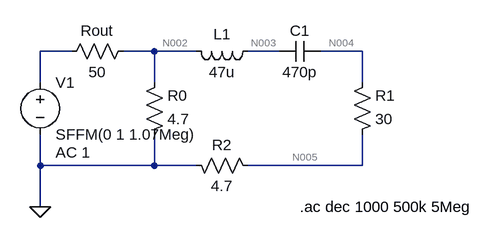
[diagram p0: schematic (1)(a).asc]
(1)(a).asc, the LTspice schematic file:
Version 4
SHEET 1 880 680
WIRE 0 32 -48 32
WIRE 128 32 80 32
WIRE 192 32 128 32
WIRE 320 32 272 32
WIRE 448 32 384 32
WIRE -48 80 -48 32
WIRE 128 80 128 32
WIRE 448 80 448 32
WIRE -48 208 -48 160
WIRE 128 208 128 160
WIRE 128 208 -48 208
WIRE 192 208 128 208
WIRE 448 208 448 160
WIRE 448 208 272 208
WIRE -48 272 -48 208
FLAG -48 272 0
SYMBOL res 96 16 R90
WINDOW 0 0 56 VBottom 2
WINDOW 3 32 56 VTop 2
SYMATTR InstName Rout
SYMATTR Value 50
SYMBOL res 112 176 M180
WINDOW 0 36 76 Left 2
WINDOW 3 36 40 Left 2
SYMATTR InstName R0
SYMATTR Value 4.7
SYMBOL res 176 192 M90
WINDOW 0 0 56 VBottom 2
WINDOW 3 32 56 VTop 2
SYMATTR InstName R2
SYMATTR Value 4.7
SYMBOL res 432 176 M180
WINDOW 0 36 76 Left 2
WINDOW 3 36 40 Left 2
SYMATTR InstName R1
SYMATTR Value 30
SYMBOL cap 384 16 R90
WINDOW 0 0 32 VBottom 2
WINDOW 3 32 32 VTop 2
SYMATTR InstName C1
SYMATTR Value 470p
SYMATTR SpiceLine Rser=9.0
SYMBOL ind 288 16 R90
WINDOW 0 5 56 VBottom 2
WINDOW 3 32 56 VTop 2
SYMATTR InstName L1
SYMATTR Value 47u
SYMATTR SpiceLine Rser=5 Cpar=55p
SYMBOL voltage -48 64 R0
WINDOW 123 24 124 Left 2
WINDOW 39 0 0 Left 2
SYMATTR Value2 AC 1
SYMATTR InstName V1
SYMATTR Value SFFM(0 1 1.07Meg)
TEXT 352 272 Left 2 !.ac dec 1000 500k 5Meg

The netlist it stands for:
* (1)(a).asc
Rout N002 N001 50
R0 0 N002 4.7
R2 0 N005 4.7
R1 N005 N004 30
C1 N004 N003 470p Rser=9.0
L1 N003 N002 47u Rser=5 Cpar=55p
V1 N001 0 SFFM(0 1 1.07Meg) AC 1
.ac dec 1000 500k 5Meg
.backanno
.end

* Results of the author's LTspice run, read from the files saved beside the schematic
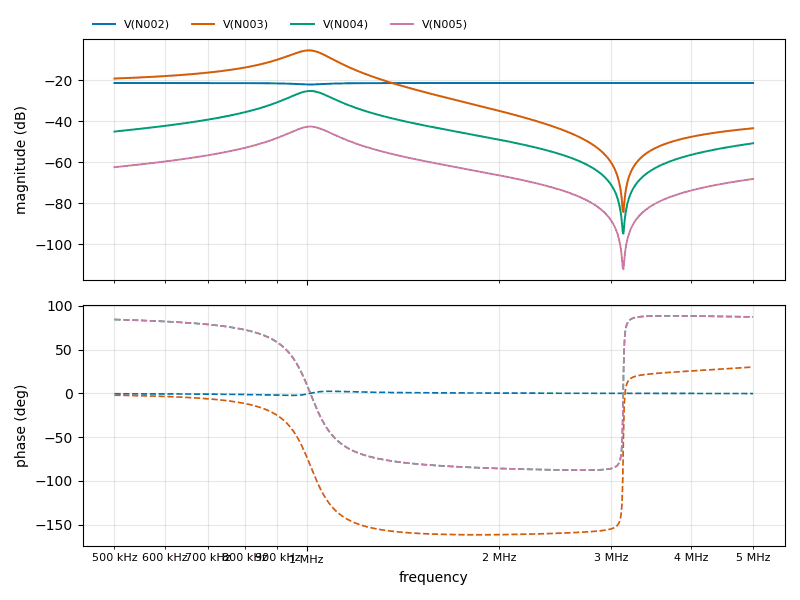
[diagram p1: AC Analysis of (1)(a).asc, plotted from the saved traces]
* AC Analysis, 1 run:
*   V(N002): -21.32 dB at 500 kHz, -21.32 dB at 5 MHz, peak -21.32 dB at 3.228 MHz
*   V(N003): -19.14 dB at 500 kHz, -43.37 dB at 5 MHz, peak -5.42 dB at 1.007 MHz, 3 dB below the peak at 929.4 kHz and 1.078 MHz
*   V(N004): -44.97 dB at 500 kHz, -50.69 dB at 5 MHz, peak -25.20 dB at 1.014 MHz, 3 dB below the peak at 940.9 kHz and 1.088 MHz
*   V(N005): -62.34 dB at 500 kHz, -68.05 dB at 5 MHz, peak -42.56 dB at 1.014 MHz, 3 dB below the peak at 940.9 kHz and 1.088 MHz